# EAGLE design full_tds (EAGLE 7.7.0)
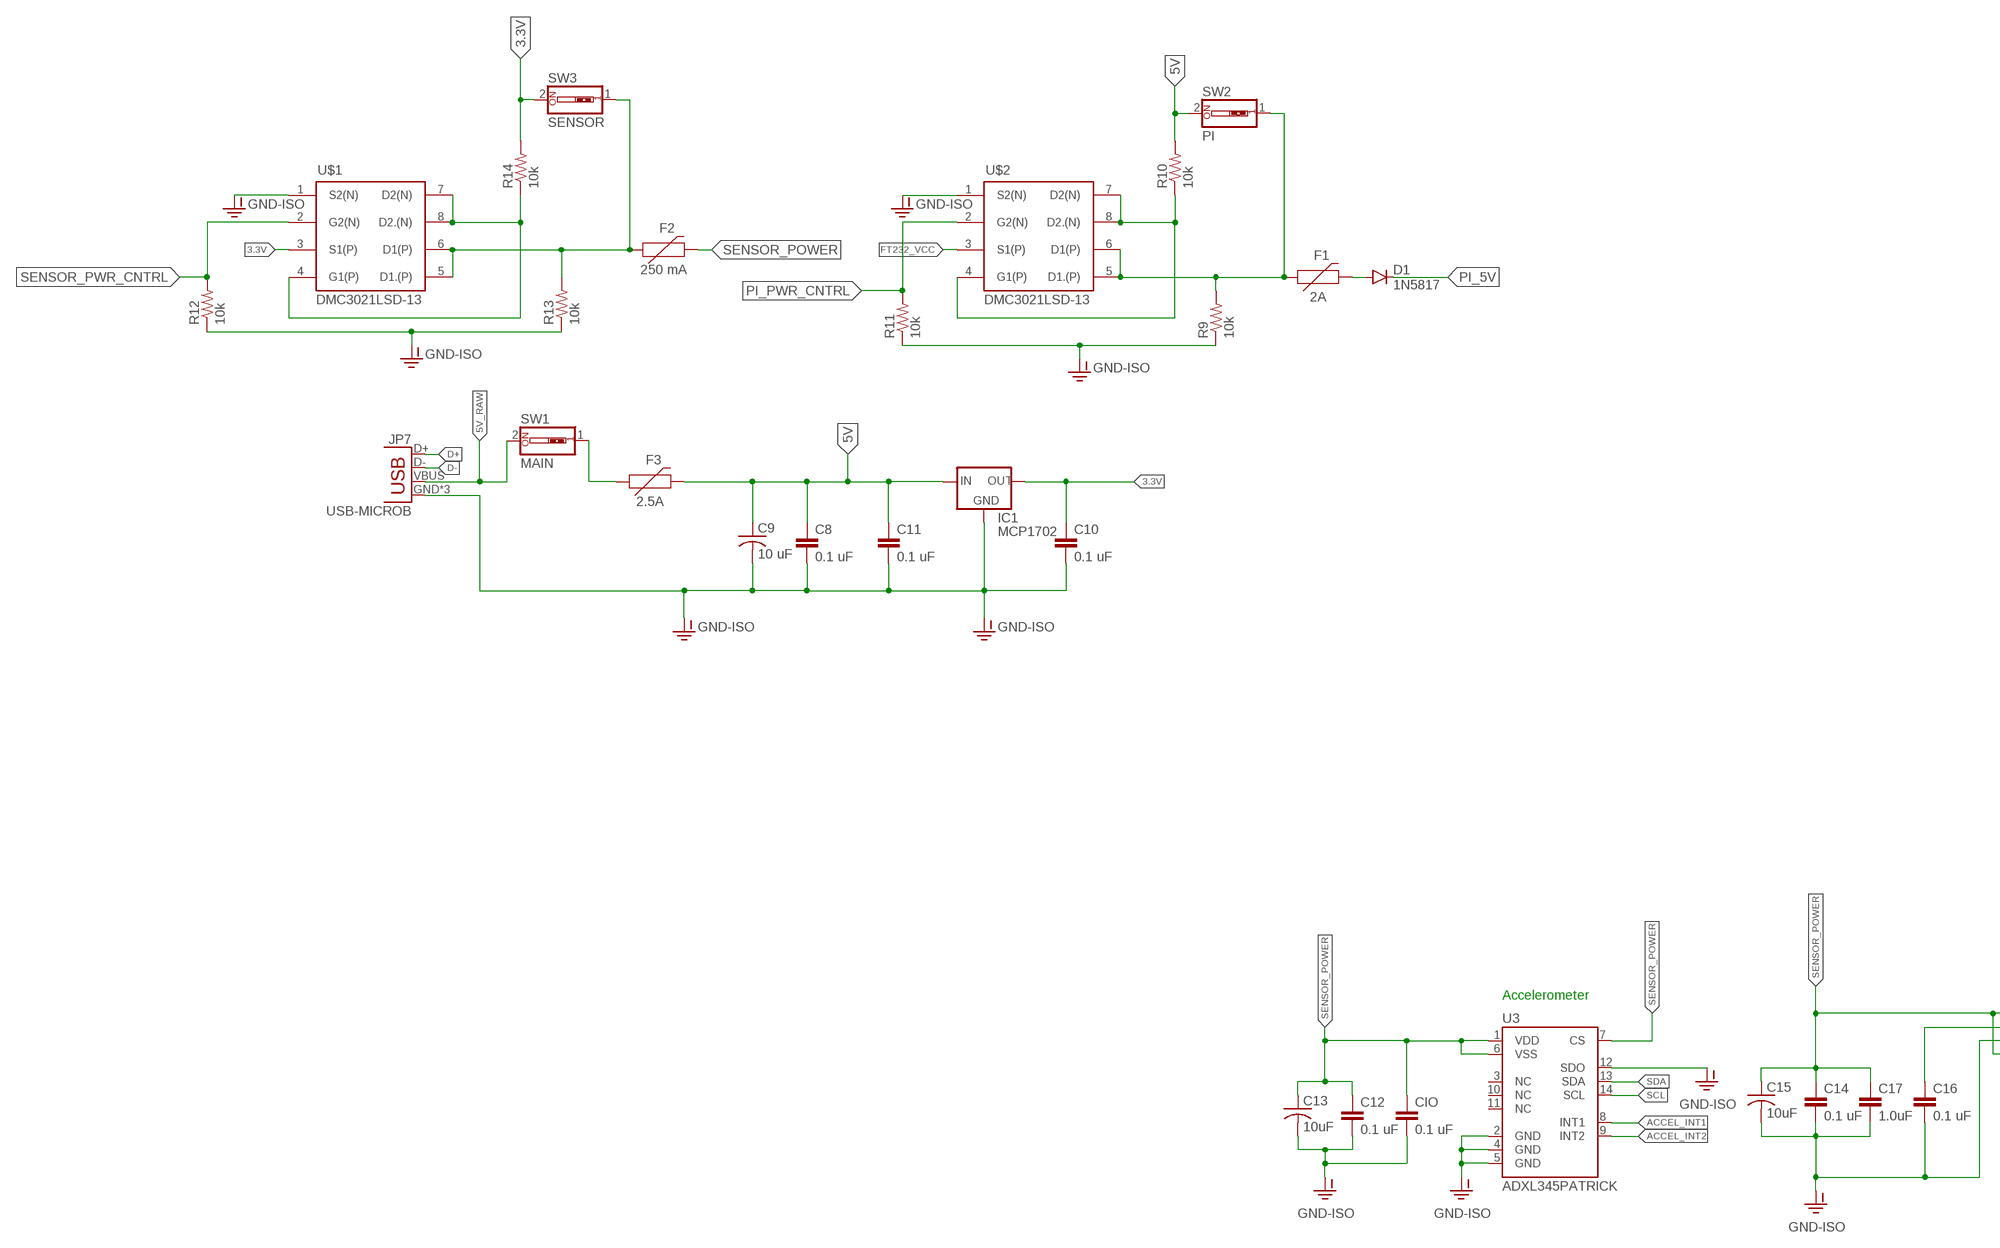
[diagram p0: schematic, sheet 1, part 1 of 2]
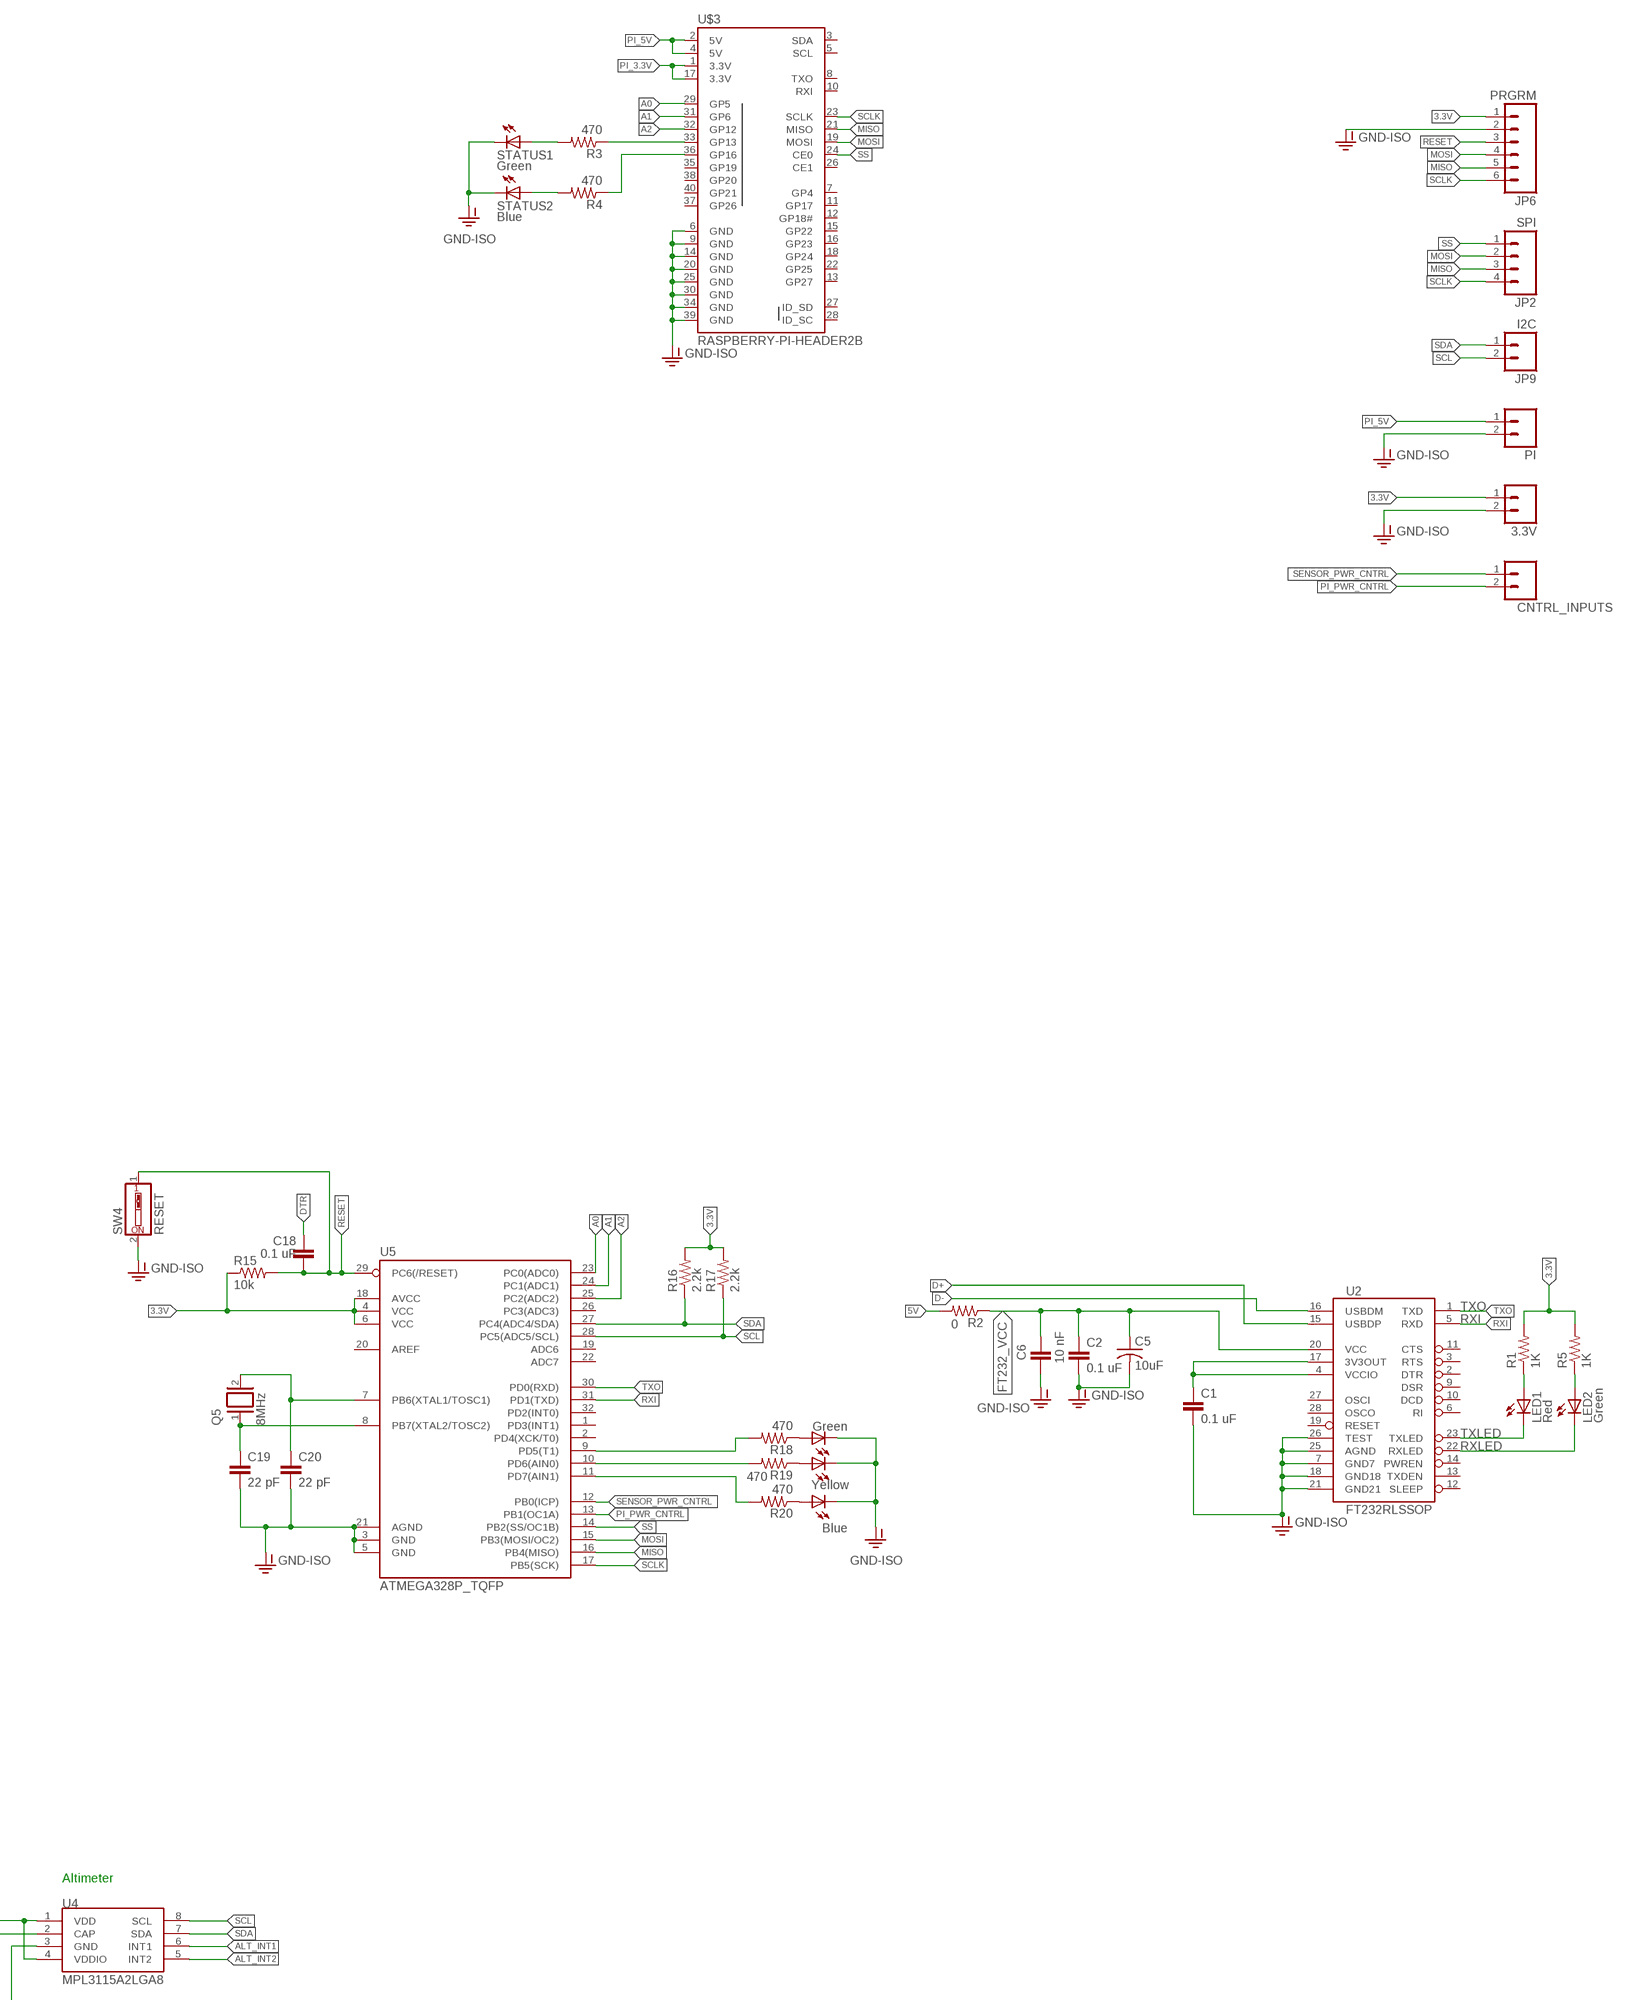
[diagram p1: schematic, sheet 1, part 2 of 2]

## Parts
3.3V  M02PTH  [1X02]
C1  0.1 uF  1.0UF-1206-50V-10%  [1206]
C2  0.1 uF  1.0UF-1206-50V-10%  [1206]
C5  10uF  C-USC1206  [C1206]
C6  10 nF  1.0UF-1206-50V-10%  [1206]
C8  0.1 uF  1.0UF-1206-50V-10%  [1206]
C9  10 uF  C-USC1206  [C1206]
C10  0.1 uF  1.0UF-1206-50V-10%  [1206]
C11  0.1 uF  1.0UF-1206-50V-10%  [1206]
C12  0.1 uF  1.0UF-1206-50V-10%  [1206]
C13  10uF  C-USC1206  [C1206]
C14  0.1 uF  1.0UF-1206-50V-10%  [1206]
C15  10uF  C-USC1206  [C1206]
C16  0.1 uF  1.0UF-1206-50V-10%  [1206]
C17  1.0uF  1.0UF-1206-50V-10%  [1206]
C18  0.1 uF  1.0UF-1206-50V-10%  [1206]
C19  22 pF  1.0UF-1206-50V-10%  [1206]
C20  22 pF  1.0UF-1206-50V-10%  [1206]
CIO  0.1 uF  1.0UF-1206-50V-10%  [1206]
CNTRL_INPUTS  M02PTH  [1X02]
D1  1N5817  DIODEPTH  [DIODE-1N4001]
F1  2A  PPTC_HALF-AMP  [1206]
F2  250 mA  PPTC_HALF-AMP  [1206]
F3  2.5A  PPTC_HALF-AMP  [1206]
IC1  MCP1702  MCP1700TRI  [TO92]
JP2  SPI  M04PTH  [1X04]
JP6  PRGRM  M06SILK_FEMALE_PTH  [1X06]
JP7  USB-MICROB  [USB-MICROB]
JP9  I2C  M02PTH  [1X02]
LED1  Red  LEDCHIPLED_1206  [CHIPLED_1206]
LED2  Green  LEDCHIPLED_1206  [CHIPLED_1206]
LED6  Green  LEDCHIPLED_1206  [CHIPLED_1206]
LED7  Yellow  LEDCHIPLED_1206  [CHIPLED_1206]
LED8  Blue  LEDCHIPLED_1206  [CHIPLED_1206]
PI  M02PTH  [1X02]
Q5  8MHz  XTAL/S  [QS]
R1  1K  RESISTOR1206  [1206]
R2  0  RESISTOR1206  [1206]
R3  470  RESISTOR1206  [1206]
R4  470  RESISTOR1206  [1206]
R5  1K  RESISTOR1206  [1206]
R9  10k  R-US_R1206  [R1206]
R10  10k  R-US_R1206  [R1206]
R11  10k  R-US_R1206  [R1206]
R12  10k  R-US_R1206  [R1206]
R13  10k  R-US_R1206  [R1206]
R14  10k  R-US_R1206  [R1206]
R15  10k  RESISTOR1206  [1206]
R16  2.2k  RESISTOR1206  [1206]
R17  2.2k  RESISTOR1206  [1206]
R18  470  RESISTOR1206  [1206]
R19  470  RESISTOR1206  [1206]
R20  470  RESISTOR1206  [1206]
STATUS1  Green  LEDCHIPLED_1206  [CHIPLED_1206]
STATUS2  Blue  LEDCHIPLED_1206  [CHIPLED_1206]
SW1  MAIN  SW_DIP-1  [EDG-01]
SW2  PI  SW_DIP-1  [EDG-01]
SW3  SENSOR  SW_DIP-1  [EDG-01]
SW4  RESET  SW_DIP-1  [EDG-01]
U2  FT232RLSSOP  [SSOP28DB]
U3  ADXL345PATRICK  [LGA14_1:1_PATRICK]
U4  MPL3115A2LGA8  [LGA8]
U5  ATMEGA328P_TQFP  [TQFP32-08]
U$1  DMC3021LSD-13  [SOIC-8]
U$2  DMC3021LSD-13  [SOIC-8]
U$3  RASPBERRY-PI-HEADER2B  [2X20-NOSILK]

## Nets
3.3V: 3.3V.1 C10.1 IC1.3(OUT) JP6.1 R1.2 R5.2 R14.2 R15.1 R16.2 R17.2 SW3.2 U5.4(VCC) U5.6(VCC) U5.18(AVCC) U$1.3(S1(P))
5V [pi]: C8.1 C9.1 C11.1 F3.2 IC1.2(IN) R2.2 R10.2 SW2.2
5V_RAW [pi]: JP7.VBUS SW1.2
5V_SWITCH [pi]: F3.1 SW1.1
A0: U5.23(PC0(ADC0)) U$3.29(GP5)
A1: U5.24(PC1(ADC1)) U$3.31(GP6)
A2: U5.25(PC2(ADC2)) U$3.32(GP12)
ACCEL_INT1: U3.8(INT1)
ACCEL_INT2: U3.9(INT2)
ALT_INT1: U4.6(INT1)
ALT_INT2: U4.5(INT2)
D+: JP7.D+ U2.15(USBDP)
D-: JP7.D- U2.16(USBDM)
DTR: C18.1
FT232_VCC: C2.1 C5.1 C6.2 R2.1 U2.20(VCC) U$2.3(S1(P))
FUSE_DIODE_PI [pi]: D1.A F1.2
GND-ISO [pi]: 3.3V.2 C1.2 C2.2 C5.2 C6.1 C8.2 C9.2 C10.2 C11.2 C12.2 C13.2 C14.2 C15.2 C16.2 C17.2 C19.2 C20.2 CIO.2 IC1.1(GND) JP6.2 JP7.GND JP7.MT1(GND) JP7.MT2(GND) LED6.C LED7.C LED8.C PI.2 R9.1 R11.1 R12.1 R13.1 STATUS1.C STATUS2.C SW4.2 U2.7(GND7) U2.18(GND18) U2.21(GND21) U2.25(AGND) U2.26(TEST) U3.2(GND) U3.4(GND) U3.5(GND) U3.12(SDO) U4.3(GND) U5.3(GND) U5.5(GND) U5.21(AGND) U$1.1(S2(N)) U$2.1(S2(N)) U$3.6(GND) U$3.9(GND) U$3.14(GND) U$3.20(GND) U$3.25(GND) U$3.30(GND) U$3.34(GND) U$3.39(GND)
GP13: R3.1 U$3.33(GP13)
GP16: R4.1 U$3.36(GP16)
MISO: JP2.3 JP6.5 U5.16(PB4(MISO)) U$3.21(MISO)
MOSI: JP2.2 JP6.4 U5.15(PB3(MOSI/OC2)) U$3.19(MOSI)
N$1: LED1.A R1.1
N$2: LED2.A R5.1
N$10: R4.2 STATUS2.A
N$11: R3.2 STATUS1.A
N$16: C16.1 U4.2(CAP)
N$25: LED6.A R18.1
N$26: LED7.A R19.1
N$27: LED8.A R20.1
PD5: R18.2 U5.9(PD5(T1))
PD6: R19.2 U5.10(PD6(AIN0))
PD7: R20.2 U5.11(PD7(AIN1))
PI_3.3V: U$3.1(3.3V) U$3.17(3.3V)
PI_5V [pi]: D1.C PI.1 U$3.2(5V) U$3.4(5V)
PI_N_DRAIN: R10.1 U$2.4(G1(P)) U$2.7(D2(N)) U$2.8(D2.(N))
PI_P_DRAIN [pi]: F1.1 R9.2 SW2.1 U$2.5(D1.(P)) U$2.6(D1(P))
PI_PWR_CNTRL: CNTRL_INPUTS.2 R11.2 U5.13(PB1(OC1A)) U$2.2(G2(N))
RESET: C18.2 JP6.3 R15.2 SW4.1 U5.29(PC6(/RESET))
RXI: U2.5(RXD) U5.31(PD1(TXD))
RXLED: LED2.C U2.22(RXLED)
SCL: JP9.2 R17.1 U3.14(SCL) U4.8(SCL) U5.28(PC5(ADC5/SCL))
SCLK: JP2.4 JP6.6 U5.17(PB5(SCK)) U$3.23(SCLK)
SDA: JP9.1 R16.1 U3.13(SDA) U4.7(SDA) U5.27(PC4(ADC4/SDA))
SENS_N_DRAIN: R14.1 U$1.4(G1(P)) U$1.7(D2(N)) U$1.8(D2.(N))
SENS_P_DRAIN: F2.1 R13.2 SW3.1 U$1.5(D1.(P)) U$1.6(D1(P))
SENSOR_POWER: C12.1 C13.1 C14.1 C15.1 C17.1 CIO.1 F2.2 U3.1(VDD) U3.6(VSS) U3.7(CS) U4.1(VDD) U4.4(VDDIO)
SENSOR_PWR_CNTRL: CNTRL_INPUTS.1 R12.2 U5.12(PB0(ICP)) U$1.2(G2(N))
SS: JP2.1 U5.14(PB2(SS/OC1B)) U$3.24(CE0)
TXLED: LED1.C U2.23(TXLED)
TXO: U2.1(TXD) U5.30(PD0(RXD))
VCCIO: C1.1 U2.4(VCCIO) U2.17(3V3OUT)
XTAL1: C20.1 Q5.2 U5.7(PB6(XTAL1/TOSC1))
XTAL2: C19.1 Q5.1 U5.8(PB7(XTAL2/TOSC2))
Unconnected: U2.2(DTR) U2.3(RTS) U2.6(RI) U2.9(DSR) U2.10(DCD) U2.11(CTS) U2.12(SLEEP) U2.13(TXDEN) U2.14(PWREN) U2.19(RESET) U2.27(OSCI) U2.28(OSCO) U3.3(NC) U3.10(NC) U3.11(NC) U5.1(PD3(INT1)) U5.2(PD4(XCK/T0)) U5.19(ADC6) U5.20(AREF) U5.22(ADC7) U5.26(PC3(ADC3)) U5.32(PD2(INT0)) U$3.3(SDA) U$3.5(SCL) U$3.7(GP4) U$3.8(TXO) U$3.10(RXI) U$3.11(GP17) U$3.12(GP18#) U$3.13(GP27) U$3.15(GP22) U$3.16(GP23) U$3.18(GP24) U$3.22(GP25) U$3.26(CE1) U$3.27(ID_SD) U$3.28(ID_SC) U$3.35(GP19) U$3.37(GP26) U$3.38(GP20) U$3.40(GP21)

## Notes on the sheet
- Altimeter
- Accelerometer

## Library data of the parts
3.3V CNTRL_INPUTS JP9 PI = SparkFun-Connectors:M02: Standard 2-pin 0.1" header. Use with - straight break away headers ( PRT-00116) - right angle break away headers (PRT-00553) - swiss pins (PRT-00743) - machine pins (PRT-00117) - female headers (PRT-00115) Molex polarized connector foot print use with: PRT-08233 with associated crimp pins and housings. 2.54_SCREWTERM for use with PRT-10571. 3.5mm Screw Terminal footprints for PRT-08084 5mm Screw Terminal footprints for use with PRT-08432
C1 C2 C6 C8 C10-C12 C14 C16 C18-C20 CIO = SparkFun-Capacitors:1.0UF: 1µF ceramic capacitors A capacitor is a passive two-terminal electrical component used to store electrical energy temporarily in an electric field.; PROD_ID: CAP-09822; VALUE: 1.0uF
C5 C9 C13 C15 = adafruit:C-US: CAPACITOR, American symbol
C17 = SparkFun-Capacitors:1.0UF: 1µF ceramic capacitors A capacitor is a passive two-terminal electrical component used to store electrical energy temporarily in an electric field.; PROD_ID: CAP-09822
D1 = SparkFun-DiscreteSemi:DIODE: Diode These are standard reverse protection diodes and small signal diodes. SMA package can handle up to about 1A. SOD-323 can handle about 200mA. What the SOD-323 package when ordering, there are some mfgs out there that are 5-pin packages.
F1-F3 = SparkFun-Fuses:PPTC: Resettable Fuse PPTC Resettable Fuse. Really a sort of resistor with a polymeric positive temperature coefficient whose resistance increases dramatically with an increase in temperature. When heated by the power passing through the resistance rises causing the current to be limited, protecting the circuit. This is achieved by the transition of the polymer from a crystalline to an amorphous state where the conductive carbon separates breaking the conductive pathways found in the cool crystalline structure. When a PPTC cools back down it resumes conducting letting the circuit turn back on. SparkFun Products: SparkFun RedBoard - Programmed with Arduino <https://www.sparkfun.com/products/12757> Pro Micro - 5V/16MHz <https://www.sparkfun.com/products/12640> Arduino Pro 328 - 5V/16MHz <https://www.sparkfun.com/products/10915> MP3 Trigger <https://www.sparkfun.com/products/13720>; PROD_ID: RES-08585; VALUE: 6V/0.5A
IC1 = adafruit:MCP1700: VOLTAGE REGULATOR
JP2 = SparkFun-Connectors:M04: Header 4 Standard 4-pin 0.1" header. Use with straight break away headers (SKU : PRT-00116), right angle break away headers (PRT-00553), swiss pins (PRT-00743), machine pins (PRT-00117), and female headers (PRT-00115). Molex polarized connector foot print use with SKU : PRT-08231 with associated crimp pins and housings. 1MM SMD Version SKU: PRT-10208
JP6 = SparkFun-Connectors:M06: Header 6 Standard 6-pin 0.1" header. Use with straight break away headers (SKU : PRT-00116), right angle break away headers (PRT-00553), swiss pins (PRT-00743), machine pins (PRT-00117), and female headers (PRT-00115). Molex polarized connector foot print use with SKU : PRT-08094 with associated crimp pins and housings. NOTES ON THE VARIANTS LOCK and LOCK_LONGPADS... This footprint was designed to help hold the alignment of a through-hole component (i.e. 6-pin header) while soldering it into place. You may notice that each hole has been shifted either up or down by 0.005 of an inch from it's more standard position (which is a perfectly straight line). This slight alteration caused the pins (the squares in the middle) to touch the edges of the holes. Because they are alternating, it causes a "brace" to hold the component in place. 0.005 has proven to be the perfect amount of "off-center" position when using our standard breakaway headers. Although looks a little odd when you look at the bare footprint, once you have a header in there, the alteration is very hard to notice. Also,if you push a header all the way into place, it is covered up entirely on the bottom side. This idea of altering the position of holes to aid alignment will be further integrated into the Sparkfun Library for other footprints. It can help hold any component with 3 or more connection pins.; PROD_ID: CONN-08437
JP7 = SparkFun-Connectors:USB: USB Connectors USB-B-PTH is fully proven SKU : PRT-00139/CONN-08278 USB-miniB is fully proven SKU : PRT-00587 USB-A-PCB is untested. USB-A-H is throughly reviewed, but untested. Spark Fun Electronics SKU : PRT-00437 USB-B-SMT is throughly reviewed, but untested. Needs silkscreen touching up. USB-A-S has not been used/tested USB-MB-H has not been used/tested USB-MICROB has been used. CONN-09505; PROD_ID: CONN-09505
LED1 LED2 LED6-LED8 STATUS1 STATUS2 = adafruit:LED: LED OSRAM: - CHIPLED LG R971, LG N971, LY N971, LG Q971, LY Q971, LO R971, LY R971 LH N974, LH R974 LS Q976, LO Q976, LY Q976 LO Q996 - Hyper CHIPLED LW Q18S LB Q993, LB Q99A, LB R99A - SideLED LS A670, LO A670, LY A670, LG A670, LP A670 LB A673, LV A673, LT A673, LW A673 LH A674 LY A675 LS A676, LA A676, LO A676, LY A676, LW A676 LS A679, LY A679, LG A679 - Hyper Micro SIDELED® LS Y876, LA Y876, LO Y876, LY Y876 LT Y87S - SmartLED LW L88C, LW L88S LB L89C, LB L89S, LG L890 LS L89K, LO L89K, LY L89K LS L896, LA L896, LO L896, LY L896 - TOPLED LS T670, LO T670, LY T670, LG T670, LP T670 LSG T670, LSP T670, LSY T670, LOP T670, LYG T670 LG T671, LOG T671, LSG T671 LB T673, LV T673, LT T673, LW T673 LH T674 LS T676, LA T676, LO T676, LY T676, LB T676, LH T676, LSB T676, LW T676 LB T67C, LV T67C, LT T67C, LS T67K, LO T67K, LY T67K, LW E67C LS E67B, LA E67B, LO E67B, LY E67B, LB E67C, LV E67C, LT E67C LW T67C LS T679, LY T679, LG T679 LS T770, LO T770, LY T770, LG T770, LP T770 LB T773, LV T773, LT T773, LW T773 LH T774 LS E675, LA E675, LY E675, LS T675 LS T776, LA T776, LO T776, LY T776, LB T776 LHGB T686 LT T68C, LB T68C - Hyper Mini TOPLED® LB M676 - Mini TOPLED Santana® LG M470 LS M47K, LO M47K, LY M47K Source: http://www.osram.convergy.de/
Q5 = special:XTAL/S: CRYSTAL
R1 R2 R5 = SparkFun-Resistors:RESISTOR: Resistor Basic schematic elements and footprints for 0603, 1206, and PTH resistors.
R3 R4 R15-R20 = SparkFun-Passives:RESISTOR: Resistor Basic schematic elements and footprints for 0603, 1206, and PTH resistors.
R9-R14 = adafruit:R-US_: RESISTOR, American symbol
SW1-SW4 = special:SW_DIP-1: DIP SWITCH
U2 = SparkFun:FT232RL: USB UART FT232RL 4th Generation USB UART (USB <-> Serial) Controller. Spark Fun Electronics SKU : COM-00650
U3 = Testing:ADXL345
U4 = SparkFun-Sensors:MPL3115A2: Altimeter/Pressure Sensor, I2C, 1.95V-3.6V supply, 50 to 110kPa
U5 = SparkFun-IC-Microcontroller:ATMEGA328P_TQFP: Popular 328P in QFP Storefront component: ATmega328 - TQFP <https://www.sparkfun.com/products/13448> (COM-13448) Datasheet <http://www.sparkfun.com/datasheets/Components/SMD/ATMega328.pdf> SparkFun Products SparkFun RedBoard - Programmed with Arduino <https://www.sparkfun.com/products/12757> (DEV-12757) Arduino Pro Mini 328 - 5V/16MHz <https://www.sparkfun.com/products/11113> (DEV-11113) Arduino Pro Mini 328 - 3.3V/8MHz <https://www.sparkfun.com/products/11114> (DEV-11114) SparkFun OpenLog <https://www.sparkfun.com/products/13712> (DEV-13712) SparkFun MicroView - OLED Arduino Module <https://www.sparkfun.com/products/12923> (DEV-12923) SparkFun Digital Sandbox <https://www.sparkfun.com/products/12651> (DEV-12651) SparkFun PicoBoard <https://www.sparkfun.com/products/11888> (WIG-11888) Arduino Fio <https://www.sparkfun.com/products/10116> (DEV-10116) LilyPad Arduino 328 Main Board <https://www.sparkfun.com/products/13342> (DEV-13342) SparkFun RedStick <https://www.sparkfun.com/products/13741> (DEV-13741) LilyPad MP3 <https://www.sparkfun.com/products/11013> (DEV-11013) LilyPad Arduino SimpleSnap <https://www.sparkfun.com/products/10941> (DEV-10941) SparkFun Stepoko <https://www.sparkfun.com/products/13899> (ROB-13899) SparkFun Geiger Counter <https://www.sparkfun.com/products/11345> (SEN-11345) SparkFun EL Sequencer <https://www.sparkfun.com/products/12781> (COM-12781) Arduino Pro 328 - 5V/16MHz <https://www.sparkfun.com/products/10915> (DEV-10915) CryptoCape <https://www.sparkfun.com/products/12773> (DEV-12773) SparkFun IR Thermometer Evaluation Board - MLX90614 <https://www.sparkfun.com/products/10740> (SEN-10740) SparkFun RedBot Mainboard <https://www.sparkfun.com/products/12097> (ROB-12097) Arduino Pro 328 - 3.3V/8MHz <https://www.sparkfun.com/products/10914> (DEV-10914) SparkFun Block for Intel® Edison - Arduino <https://www.sparkfun.com/products/13036> (DEV-13036) SparkFun Simon Says - Surface Mount Soldering Kit <https://www.sparkfun.com/products/10935> (KIT-10935) SparkFun 7-Segment Serial Display - Red <https://www.sparkfun.com/products/11441> (COM-11441) SparkFun 7-Segment Serial Display - White <https://www.sparkfun.com/products/11629> (COM-11629) SparkFun 7-Segment Serial Display - Yellow <https://www.sparkfun.com/products/11443> (COM-11443) SparkFun 7-Segment Serial Display - Kelly Green <https://www.sparkfun.com/products/11440> (COM-11440) SparkFun 7-Segment Serial Display - Blue <https://www.sparkfun.com/products/11442> (COM-11442) SparkFun OpenSegment Serial Display - 20mm (Blue) <https://www.sparkfun.com/products/11647> (COM-11647) SparkFun OpenSegment Serial Display - 20mm (Green) <https://www.sparkfun.com/products/11646> (COM-11646) SparkFun OpenSegment Serial Display - 20mm (White) <https://www.sparkfun.com/products/11648> (COM-11648) SparkFun OpenSegment Serial Display - 20mm (Red) <https://www.sparkfun.com/products/11644> (COM-11644) SparkFun OpenSegment Serial Display - 20mm (Yellow) <https://www.sparkfun.com/products/11645> (COM-11645) SparkFun OpenSegment Shield <https://www.sparkfun.com/products/13190> (DEV-13190); PROD_ID: IC-09069
U$1 U$2 = custom:DMC3021LSD
U$3 = custom:RASPBERRY-PI-HEADER

## Net classes
1 actuator: width 0.813 mm, clearance 0.229 mm
2 pi: width 0.508 mm

## Board
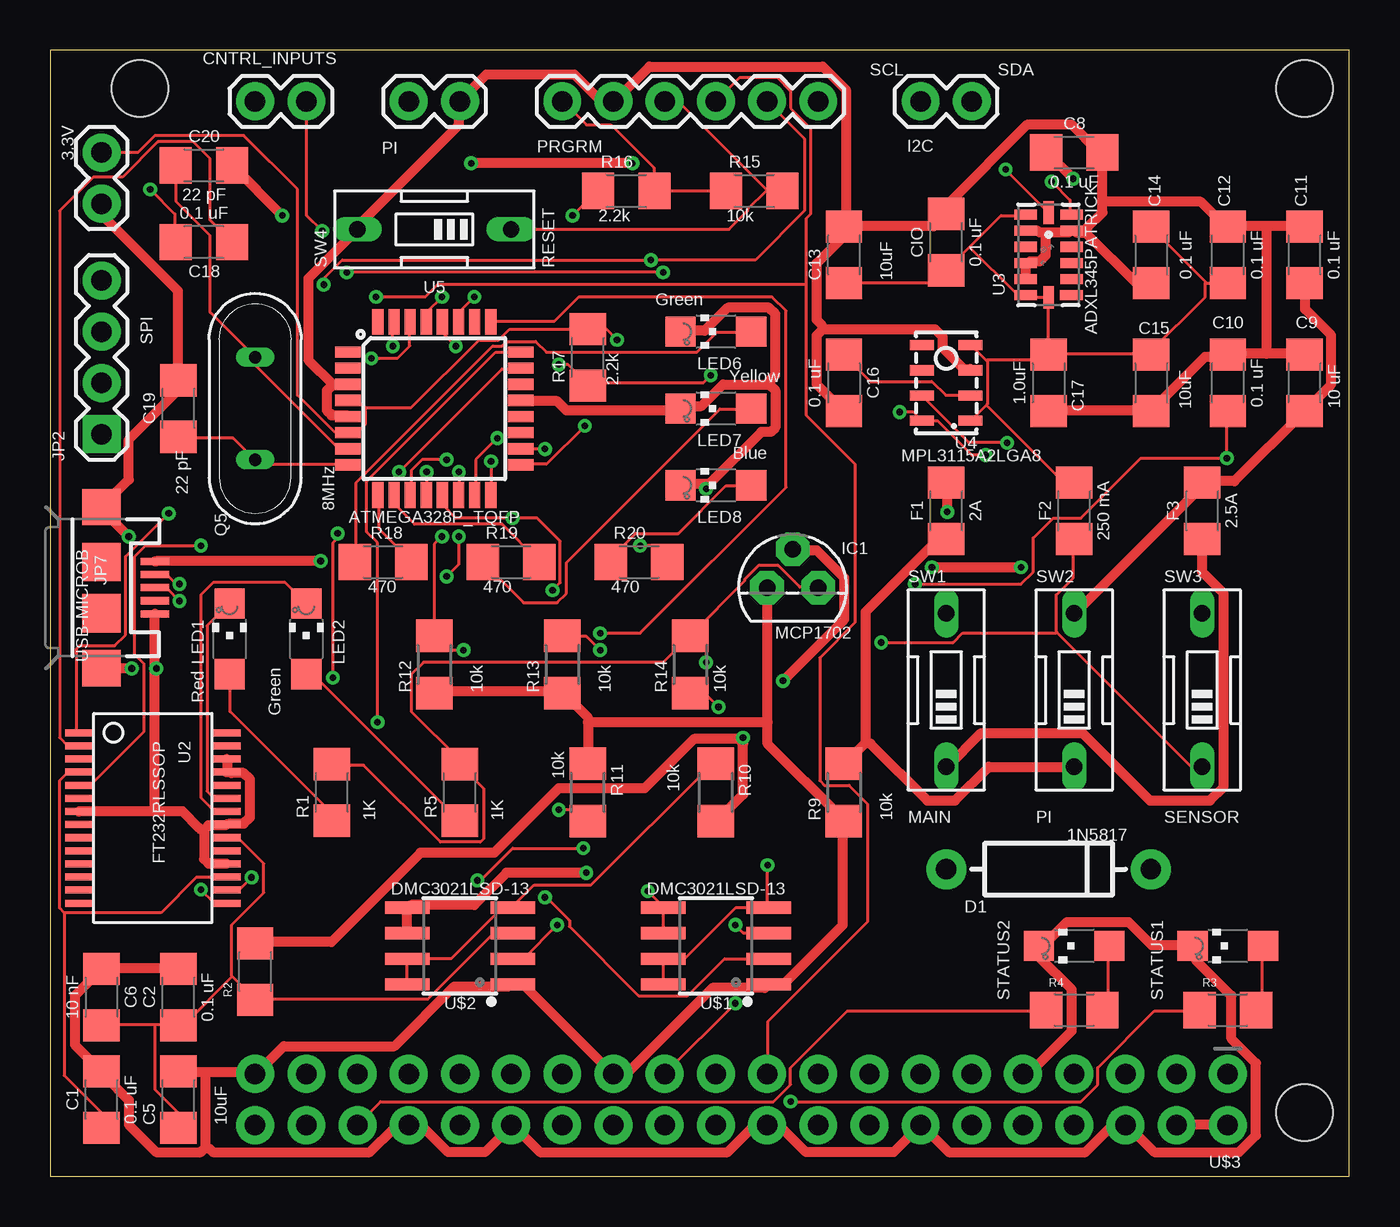
[diagram p2: board, top side]
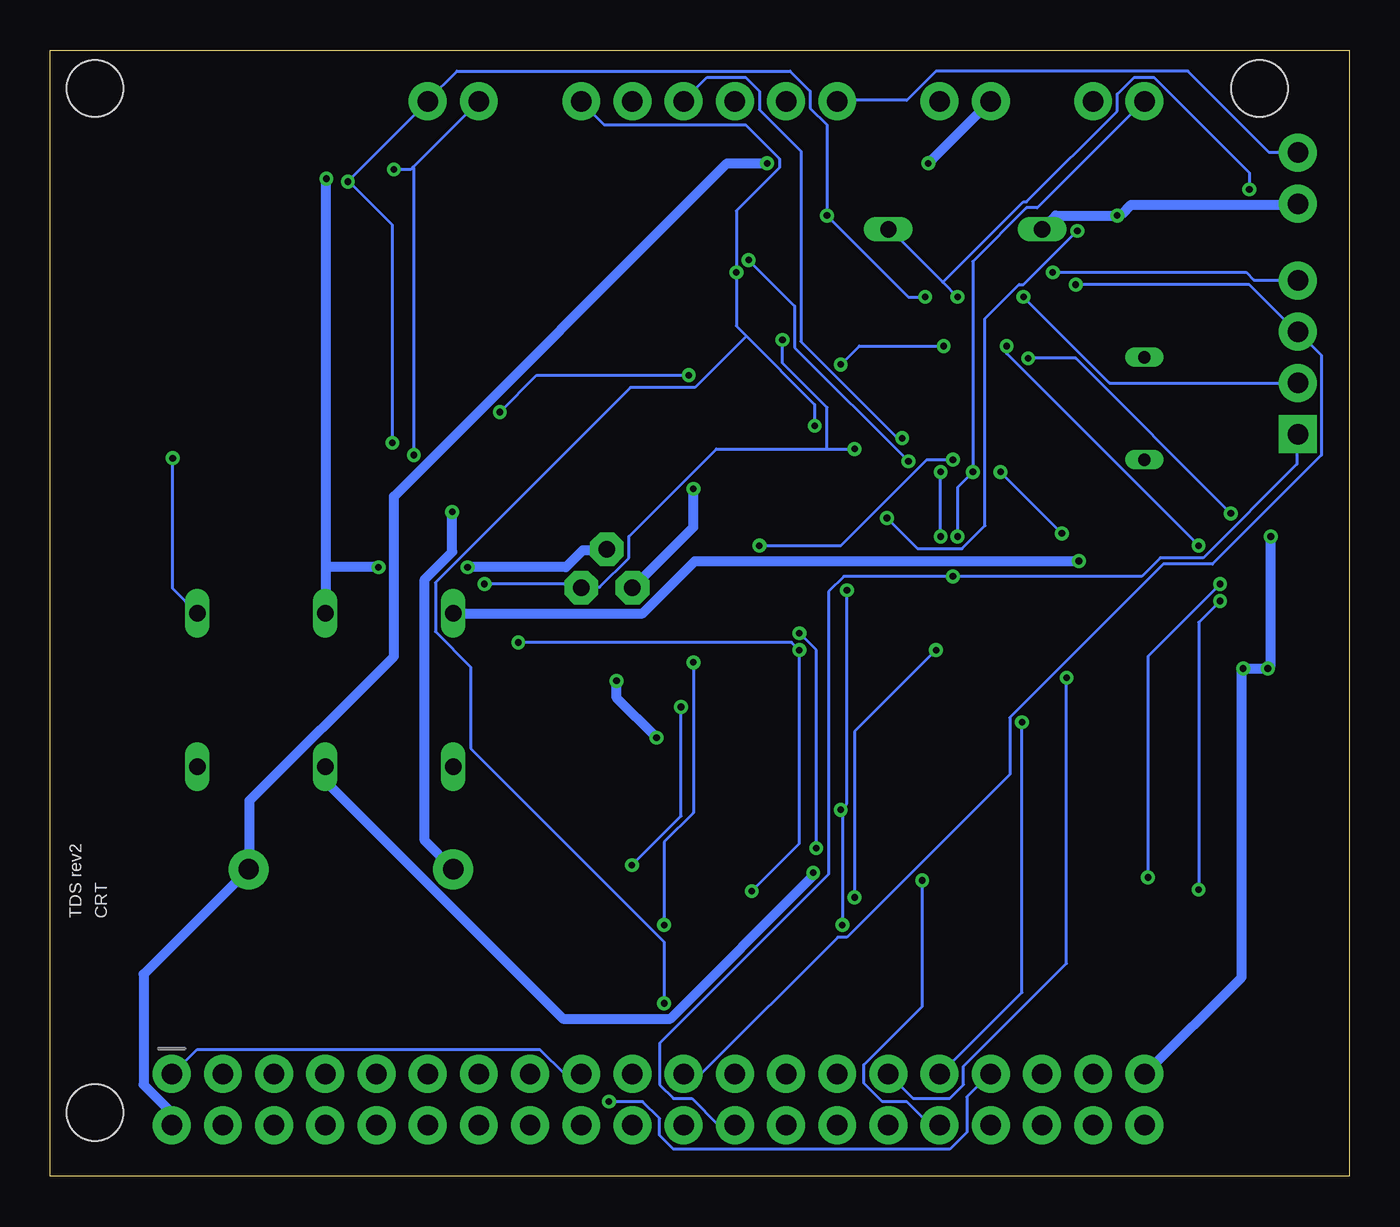
[diagram p3: board, bottom side, seen from below]

Size 64.44 x 55.87 mm. Coordinates in mm from the lower left corner, seen from the top.
Outline: 0,0 64.44,0 64.44,55.87 0,55.87 0,0
Copper layers (1*16): Top 0.0356mm / dielectric 1.5011mm / Bottom 0.0356mm
Design rules "LaenPCBOrder": minimum track width 6mil, minimum drill 13mil, track to track 6mil, track to pad 6mil, pad to pad 6mil, via to via 6mil, smd to smd 6mil, copper to edge 15mil, drill to drill 6mil, minimum pad ring 7mil, minimum via ring 7mil, stop-mask expansion 3mil, vias tented up to drill 0mil, thermal gap 10mil
Holes 2.8 mm at 62.23,53.98 62.23,3.17 4.44,53.98

### Footprints (pad centres in the part's own frame; a part is rotated, then mirrored left to right if it is on the bottom)
1X02 = drill 1.016 pad 1.88: 1 0,0; 2 2.54,0
1206 = smd 1.6 x 1.8: 1 -1.4,0; 2 1.4,0
C1206 = smd 1.6 x 1.8: 1 -1.4,0; 2 1.4,0
DIODE-1N4001 = drill 1 pad 1.981: A -5.08,0; C 5.08,0
TO92 = drill 0.813 pad 1.676 octagon: 1 -1.27,0; 2 0,1.905; 3 1.27,0
1X04 = drill 1.016 pad 1.88 square: 1 0,0 | drill 1.016 pad 1.88: 2 2.54,0; 3 5.08,0; 4 7.62,0
1X06 = drill 1.016 pad 1.88: 1 0,0; 2 2.54,0; 3 5.08,0; 4 7.62,0; 5 10.16,0; 6 12.7,0
USB-MICROB = smd 0.35 x 1.4: D+ 0,2.65; D- -0.65,2.65; GND 1.3,2.65; ID 0.65,2.65; VBUS -1.3,2.65 | smd 1.8 x 1.9: MT1 -4,0; MT2 4,0 | smd 1.9 x 1.9: P$1 -1.27,0; P$2 1.27,0
CHIPLED_1206 = smd 1.5 x 1.5: A 0,-1.75; C 0,1.75
QS = drill 0.61 long: 1 -2.54,0; 2 2.54,0
R1206 = smd 1.6 x 1.803: 1 -1.422,0; 2 1.422,0
EDG-01 = drill 0.813 long: 1 0,-3.81; 2 0,3.81
SSOP28DB = smd 0.348 x 1.397: 1 -4.225,-3.656; 2 -3.575,-3.656; 3 -2.925,-3.656; 4 -2.275,-3.656; 5 -1.625,-3.656; 6 -0.975,-3.656; 7 -0.325,-3.656; 8 0.325,-3.656; 9 0.975,-3.656; 10 1.625,-3.656; 11 2.275,-3.656; 12 2.925,-3.656; 13 3.575,-3.656; 14 4.225,-3.656; 15 4.225,3.656; 16 3.575,3.656; 17 2.925,3.656; 18 2.275,3.656; 19 1.625,3.656; 20 0.975,3.656; 21 0.325,3.656; 22 -0.325,3.656; 23 -0.975,3.656; 24 -1.625,3.656; 25 -2.275,3.656; 26 -2.925,3.656; 27 -3.575,3.656; 28 -4.225,3.656
LGA14_1:1_PATRICK = smd 0.5 x 1.124: 1 2,1.138; 2 1.2,1.138; 3 0.4,1.138; 4 -0.4,1.138; 5 -1.2,1.138; 6 -2,1.138; 8 -2,-1.13; 9 -1.2,-1.138; 10 -0.4,-1.138; 11 0.4,-1.138; 12 1.2,-1.138; 13 2,-1.138 | smd 1.124 x 0.5: 7 -2.1,0; 14 2.1,0
LGA8 = smd 1.2 x 0.5: 1 -1.2,1.875; 2 -1.2,0.625; 3 -1.2,-0.625; 4 -1.2,-1.875; 5 1.2,-1.875; 6 1.2,-0.625; 7 1.2,0.625; 8 1.2,1.875
TQFP32-08 = smd 1.27 x 0.559: 1 -4.293,2.8; 2 -4.293,2; 3 -4.293,1.2; 4 -4.293,0.4; 5 -4.293,-0.4; 6 -4.293,-1.2; 7 -4.293,-2; 8 -4.293,-2.8; 17 4.293,-2.8; 18 4.293,-2; 19 4.293,-1.2; 20 4.293,-0.4; 21 4.293,0.4; 22 4.293,1.2; 23 4.293,2; 24 4.293,2.8 | smd 0.559 x 1.27: 9 -2.8,-4.293; 10 -2,-4.293; 11 -1.2,-4.293; 12 -0.4,-4.293; 13 0.4,-4.293; 14 1.2,-4.293; 15 2,-4.293; 16 2.8,-4.293; 25 2.8,4.293; 26 2,4.293; 27 1.2,4.293; 28 0.4,4.293; 29 -0.4,4.293; 30 -1.2,4.293; 31 -2,4.293; 32 -2.8,4.293
SOIC-8 = smd 0.61 x 2.21: 1 -1.905,-2.616; 2 -0.635,-2.616; 3 0.635,-2.616; 4 1.905,-2.616; 5 1.905,2.616; 6 0.635,2.616; 7 -0.635,2.616; 8 -1.905,2.616
2X20-NOSILK = drill 1.016 pad 1.88: 1 0,0; 2 0,2.54; 3 2.54,0; 4 2.54,2.54; 5 5.08,0; 6 5.08,2.54; 7 7.62,0; 8 7.62,2.54; 9 10.16,0; 10 10.16,2.54; 11 12.7,0; 12 12.7,2.54; 13 15.24,0; 14 15.24,2.54; 15 17.78,0; 16 17.78,2.54; 17 20.32,0; 18 20.32,2.54; 19 22.86,0; 20 22.86,2.54; 21 25.4,0; 22 25.4,2.54; 23 27.94,0; 24 27.94,2.54; 25 30.48,0; 26 30.48,2.54; 27 33.02,0; 28 33.02,2.54; 29 35.56,0; 30 35.56,2.54; 31 38.1,0; 32 38.1,2.54; 33 40.64,0; 34 40.64,2.54; 35 43.18,0; 36 43.18,2.54; 37 45.72,0; 38 45.72,2.54; 39 48.26,0; 40 48.26,2.54

### Placement (x,y rotation side)
3.3V  2.54,50.8 270 top
C1  2.54,3.81 90 top
C2  6.35,8.89 90 top
C5  6.35,3.81 90 top
C6  2.54,8.89 270 top
C8  50.8,50.8 0 top
C9  62.23,39.37 90 top
C10  58.42,39.37 90 top
C11  62.23,45.72 90 top
C12  58.42,45.72 90 top
C13  39.37,45.72 90 top
C14  54.61,45.72 270 top
C15  54.61,39.37 270 top
C16  39.37,39.37 270 top
C17  49.53,39.37 270 top
C18  7.62,46.36 180 top
C19  6.35,38.1 90 top
C20  7.62,50.16 0 top
CIO  44.45,46.36 90 top
CNTRL_INPUTS  10.16,53.34 0 top
D1  49.53,15.24 0 top
F1  44.45,33.02 90 top
F2  50.8,33.02 90 top
F3  57.15,33.02 90 top
IC1  36.83,29.21 0 top
JP2  2.54,36.83 90 top
JP6  25.4,53.34 0 top
JP7  2.54,29.21 270 top
JP9  45.72,53.34 180 top
LED1  8.89,26.67 0 top
LED2  12.7,26.67 0 top
LED6  33.02,41.91 90 top
LED7  33.02,38.1 90 top
LED8  33.02,34.29 90 top
PI  17.78,53.34 0 top
Q5  10.16,38.1 90 top
R1  13.97,19.05 90 top
R2  10.16,10.16 90 top
R3  58.42,8.25 0 top
R4  50.8,8.25 0 top
R5  20.32,19.05 90 top
R9  39.37,19.05 90 top
R10  33.02,19.05 270 top
R11  26.67,19.05 270 top
R12  19.05,25.4 90 top
R13  25.4,25.4 90 top
R14  31.75,25.4 90 top
R15  34.92,48.9 0 top
R16  28.57,48.9 0 top
R17  26.67,40.64 90 top
R18  16.51,30.48 0 top
R19  22.86,30.48 0 top
R20  29.21,30.48 0 top
STATUS1  58.42,11.43 90 top
STATUS2  50.8,11.43 90 top
SW1  44.45,24.13 0 top
SW2  50.8,24.13 0 top
SW3  57.15,24.13 0 top
SW4  19.05,46.99 90 top
U2  5.08,17.78 270 top
U3  49.53,45.72 90 top
U4  44.45,39.37 180 top
U5  19.05,38.1 0 top
U$1  33.02,11.43 90 top
U$2  20.32,11.43 90 top
U$3  58.42,5.08 180 top

### Tracks (layer width: path | path; a pad name or v marks a point on that pad's centre or on a via)
3.3V  (via drill 0.33)
  Top 0.152: R15.1 R16.2 29.95,48.9 29.95,50.04 27.81,52.17 26.59,52.17 25.45,53.31 JP6.1 | 15.58,38.11 15.24,38.46 14.78,38.46 U5.4 | 15.58,38.11 15.62,38.08 15.62,37.31 15.24,36.93 14.78,36.93 U5.6 14.71,36.93 14.1,36.93 12.27,38.76 12.27,48.97 9.6,51.64 5.18,51.64 4.34,50.8 3.3V.1 | R17.2 22.78,42.04 22.25,41.5 21.26,41.5 17.91,38.15 15.62,38.15 15.58,38.11 | C10.1 58.37,37.92 v58.37,35.64 54.1,35.64 51.13,32.66 49.76,32.66 48.77,31.67 48.77,30 48.16,29.39 v42.9,29.39 | R1.2 14.02,20.4 15.54,20.4 19.35,16.59 21.34,16.59 21.49,16.74 21.49,19.25 20.34,20.4 R5.2 20.27,20.47 20.27,20.7 17.91,23.06 17.91,24.89 18.52,25.5 30.4,25.5 31.7,26.8 R14.2 | v24.54,36.09 23.39,36.09 U5.18 | R14.2 31.77,26.87 34.44,29.54 34.44,29.62 35.13,30.3 36.12,30.3 37.19,29.23 38.1,29.23 IC1.3 | v33.98,12.47 34.37,12.09 35.59,12.09 U$1.3 | v32.54,25.5 32.54,26.04 31.77,26.8 R14.2 | R17.2 27.58,42.04 v28.12,41.5 | R17.2
  Bottom 0.152: 3.3V.1 3.96,50.8 8,54.84 20.5,54.84 21.95,53.39 25.38,53.39 JP6.1 | v58.37,35.64 58.37,29.16 SW3.2 | 25.91,36.09 31.39,36.09 35.74,31.75 35.74,30.68 37.19,29.23 38.1,29.23 | 25.91,36.09 v24.54,36.09 | v33.98,12.47 33.98,16.59 32.54,18.03 v32.54,25.5 | v42.9,29.39 38.25,29.39 38.1,29.23 | 38.1,29.23 IC1.3 | v28.12,41.5 28.12,40.36 25.91,38.15 25.91,36.09
5V  (via drill 0.33)
  Top 0.508: C11.1 62.26,44.25 62.26,43.03 63.55,41.73 63.55,39.29 62.41,38.15 C9.1 62.18,37.92 58.75,34.49 57.15,34.49 F3.2 57.07,34.19 50.82,27.94 SW2.2 | v50.75,49.51 49.45,50.8 C8.1 | 34.14,21.69 31.93,21.69 29.49,19.25 25.22,19.25 22.02,16.05 18.36,16.05 13.94,11.63 10.21,11.63 R2.2 | 34.14,21.69 34.37,21.46 34.37,18.95 33.07,17.65 R10.2 | v36.35,24.59 39.39,27.64 39.39,29.69 38.02,31.06 36.88,31.06 IC1.2 | v34.37,21.77 34.14,21.69 | v43.74,30.23 v48.16,30.23
  Bottom 0.508: 50.75,30.23 50.75,27.94 SW2.2 | 50.75,30.23 v50.75,49.51 | v36.35,24.59 36.35,23.75 v34.37,21.77 | v48.16,30.23 50.75,30.23 | v43.74,30.23 38.86,30.23 38.02,31.06 36.88,31.06 IC1.2
5V_RAW  (via drill 0.33)
  Top 0.508: v13.41,30.53 5.26,30.53 JP7.VBUS
  Bottom 0.508: v13.41,30.53 32.46,30.53 35.05,27.94 SW1.2
5V_SWITCH
  Top 0.508: F3.1 57.15,30 58.22,28.93 58.22,19.33 57.53,18.64 54.56,18.64 51.21,22 46.18,22 44.5,20.32 SW1.1
A0  (via drill 0.33)
  Top 0.152: v17.3,34.95 22.4,40.06 23.32,40.06 U5.23 | v14.25,31.9 14.25,31.67 14.02,31.45 v14.02,24.74
  Bottom 0.152: v14.25,31.9 v17.3,34.95 | v14.02,24.74 14.02,10.57 19.13,5.46 19.13,4.55 19.81,3.86 21.64,3.86 U$3.29
A1  (via drill 0.33)
  Top 0.152: v16.23,22.53 16.23,31.45 15.7,31.98 15.7,34.49 22.1,40.89 23.32,40.89 U5.24
  Bottom 0.152: v16.23,22.53 16.23,9.12 20.27,5.08 U$3.31
A2  (via drill 0.33)
  Top 0.152: v27.28,26.95 29.26,26.95 36.5,34.19 36.5,42.95 35.81,43.64 26.21,43.64 24.99,42.42 21.87,42.42 U5.25 | v26.44,16.28 22.94,16.28 21.34,14.68 v21.18,14.68
  Bottom 0.152: v27.28,26.95 26.44,26.11 v26.44,16.28 | v21.18,14.68 21.18,8.43 24.08,5.54 24.08,4.62 23.16,3.71 21.95,3.71 20.8,2.57 20.34,2.57 U$3.32
D+  (via drill 0.33)
  Top 0.152: v7.47,14.22 8.08,13.61 8.69,13.61 U2.15 | v6.4,28.55 5.79,29.16 5.26,29.16 JP7.D+
  Bottom 0.152: v7.47,14.22 7.47,27.48 v6.4,28.55
D-  (via drill 0.33)
  Top 0.152: v9.98,14.83 9.37,14.22 8.76,14.22 U2.16 | v6.4,29.39 6.25,29.39 5.79,29.84 5.26,29.84 JP7.D-
  Bottom 0.152: v9.98,14.83 9.98,25.81 v6.4,29.39
DTR
  Top 0.152: 1.37,21.39 0.84,21.39 0.46,21.77 0.46,47.9 2.13,49.58 3.58,49.58 5.33,51.33 7.09,51.33 7.92,50.49 7.92,47.45 8.99,46.38 C18.1
FT232_VCC
  Top 0.152: 5.18,7.52 6.33,7.52 C2.1 6.4,7.52 6.63,7.52 9.03,9.92 | 5.18,7.52 2.59,7.52 C6.2 | 5.18,7.52 5.18,4.32 6.33,3.17 6.33,2.41 C5.1 | 9.03,9.92 10.13,8.81 R2.1 10.21,8.81 18.74,8.81 21.95,12.01 22.94,12.01 U$2.3 | 9.03,9.92 8.99,9.96 8.99,12.47 10.59,14.07 10.59,15.52 9.37,16.74 8.76,16.74 U2.20
FUSE_DIODE_PI  (via drill 0.33)
  Top 0.508: v44.5,32.97 44.5,34.42 F1.2
  Bottom 0.508: v44.5,32.97 44.5,30.99 45.87,29.62 45.87,16.66 D1.A
GND-ISO  (via drill 0.33)
  Top 0.508: C13.2 39.39,47.14 43.81,47.14 44.42,47.75 CIO.2 44.5,47.98 44.5,48.21 48.46,52.17 50.67,52.17 51.97,50.88 C8.2 52.2,48.36 | 38.33,42.04 43.89,42.04 44.27,41.66 44.27,41.12 45.34,40.06 45.64,40.06 U4.3 | 38.33,42.04 38.02,41.73 38.02,39.29 39.32,38 C16.2 | C13.2 39.24,46.91 39.24,46.53 38.02,45.31 38.02,42.49 38.25,42.27 38.33,42.04 | U3.5 48.39,44.55 U3.4 48.62,45.39 49.07,45.39 49.38,45.7 49.38,46.84 | 49.38,46.84 50.52,46.84 50.6,46.91 U3.12 50.9,46.84 51.36,46.84 | 49.38,46.84 49.07,46.84 49,46.91 48.46,46.91 U3.2 | 51.36,46.84 53.87,44.32 54.56,44.32 C14.2 | 52.2,48.36 52.2,47.83 51.43,47.07 51.36,46.84 | 60.35,47.14 62.18,47.14 C11.2 | 60.35,47.14 58.45,47.14 C12.2 58.22,47.22 57.07,48.36 52.2,48.36 | 60.35,40.82 62.18,40.82 C9.2 | 60.35,40.82 58.45,40.82 C10.2 58.22,40.66 57.3,40.66 54.79,38.15 C15.2 54.56,38 49.53,38 C17.2 | 60.35,40.82 60.35,47.14 | 14.02,39.29 13.72,38.99 13.72,38 13.94,37.77 14.71,37.77 U5.5 | 14.02,39.29 14.71,39.29 U5.3 | v11.51,47.68 9.07,50.11 C20.2 | 14.02,39.29 12.8,40.51 12.8,44.55 SW4.2 15.32,47.22 20.27,52.17 20.27,53.31 PI.2 20.5,53.54 21.64,54.69 25.98,54.69 27.28,53.39 27.89,53.39 JP6.2 28.12,53.47 29.72,55.07 38.33,55.07 39.47,53.92 39.47,47.37 C13.2 | 3.3V.2 2.59,48.21 2.59,47.68 6.33,43.94 6.33,39.75 C19.2 6.33,39.45 6.33,38.99 3.89,36.55 3.89,34.57 2.59,33.27 JP7.MT1 2.67,32.97 v3.89,31.75 | U5.21 23.39,38.46 25.15,38.46 25.6,38 31.17,38 31.24,38.08 LED7.C 31.47,38.23 32.31,38.23 33.38,39.29 35.66,39.29 | 32.54,34.34 32.69,34.34 35.28,36.93 35.74,36.93 35.97,37.16 35.97,38.99 35.66,39.29 | 32.54,34.34 31.32,34.34 LED8.C
  Top 0.508: LED6.C 31.32,41.96 32.46,41.96 33.6,43.1 35.66,43.1 35.97,42.8 35.97,39.75 35.74,39.52 35.66,39.29 | R12.1 19.05,24.05 25.38,24.05 R13.1 25.6,23.82 26.67,22.76 26.67,22.53 | 26.67,22.53 R11.1 | 35.59,22.53 35.59,21.46 39.24,17.8 R9.1 39.32,17.58 39.32,12.47 36.42,9.58 35.66,9.58 U$1.1 35.43,9.35 32.84,9.35 28.73,5.23 28.12,5.23 U$3.25 27.89,5.08 23.47,9.5 22.94,9.5 U$2.1 22.71,9.42 20.04,9.42 17.07,6.45 11.58,6.45 10.36,5.23 U$3.39 10.13,5.08 10.06,5.16 7.7,5.16 | 35.59,22.53 35.59,29.16 IC1.1 | 35.59,22.53 26.67,22.53 | v32.54,34.11 32.54,34.34 | U$3.9 48.54,5.08 50.67,7.21 50.67,9.27 49.07,10.87 49.07,11.41 STATUS2.C 49.3,11.48 50.44,12.62 53.49,12.62 54.63,11.48 56.62,11.48 STATUS1.C 56.84,11.25 56.84,10.72 58.6,8.97 58.6,6.83 59.82,5.61 59.82,2.03 58.98,1.19 54.79,1.19 53.57,2.41 U$3.6 53.34,2.49 52.65,2.49 51.36,1.19 44.58,1.19 43.36,2.41 U$3.14 41.83,1.19 37.49,1.19 36.2,2.49 35.59,2.49 U$3.20 35.36,2.41 34.82,2.41 33.6,1.19 24.31,1.19 23.09,2.41 U$3.30 22.86,2.49 21.56,1.19 19.74,1.19 18.44,2.49 17.83,2.49 U$3.34 17.6,2.41 17.07,2.41 15.85,1.19 8.08,1.19 7.92,1.35 7.7,1.42 | U2.26 8.76,20.7 8.76,20.09 U2.25 8.99,20.02 9.6,20.02 9.91,19.71 9.91,17.8 9.6,17.5 8.99,17.5 U2.21 8.69,17.42 7.85,17.42 7.62,17.2 | 7.62,17.2 7.62,15.75 7.85,15.52 8.69,15.52 U2.18 | 5.18,18.11 6.55,18.11 7.39,17.27 7.62,17.2 | 5.18,18.11 1.45,18.11 U2.7 | 5.18,18.11 5.18,25.2 | 5.18,25.2 5.18,27.86 JP7.GND | v4.04,25.2 2.59,25.2 JP7.MT2 | v5.26,25.2 5.18,25.2 | 7.7,5.16 6.4,5.16 C5.2 | C2.2 6.33,10.34 2.74,10.34 C6.1 2.51,10.26 1.22,8.97 1.22,6.53 2.51,5.23 C1.2 2.67,5 3.89,3.79 3.89,2.57 5.26,1.19 7.47,1.19 7.7,1.42
  Top 0.508: 7.7,1.42 7.7,5.16
  Bottom 0.508: SW4.2 14.55,47.68 v11.51,47.68 11.28,47.75 10.82,48.21 2.59,48.21 3.3V.2 | v32.54,34.11 32.54,32.21 35.51,29.23 IC1.1 | U$3.39 10.13,5.08 5.33,9.88 5.33,24.97 v5.26,25.2 v4.04,25.2 3.89,25.35 v3.89,31.75
GP13  (via drill 0.33)
  Top 0.152: v36.73,3.71 51.13,3.71 51.97,4.55 51.97,5.38 54.79,8.2 57,8.2 R3.1
  Bottom 0.152: v36.73,3.71 35.05,3.71 34.21,2.87 34.21,2.03 33.53,1.35 19.81,1.35 18.97,2.18 18.97,3.94 17.83,5.08 U$3.33
GP16
  Top 0.152: R4.1 49.38,8.2 39.55,8.2 36.73,5.38 36.73,4.55 35.89,3.71 16.38,3.71 15.24,2.57 U$3.36
MISO  (via drill 0.33)
  Top 0.152: v21.87,35.48 21.87,33.81 U5.16 | JP6.5 37.41,51.49 37.41,47.9 34.98,45.47 v29.79,45.47 14.48,45.47 13.56,44.55 v13.56,44.25
  Bottom 0.152: v21.87,35.48 27.51,41.12 27.51,43.18 v29.79,45.47 | U$3.21 32.16,5.08 25.38,11.86 24.92,11.86 16.84,19.94 16.84,22.76 9.22,30.38 6.78,30.38 1.37,35.79 1.37,40.74 JP2.3 2.59,41.88 4.95,44.25 v13.56,44.25
MOSI  (via drill 0.33)
  Top 0.152: v22.17,36.63 21.11,35.56 21.11,33.81 U5.15 | 37.49,44.25 37.49,47.52 37.72,47.75 37.72,52.02 36.73,53.01 36.73,53.85 36.04,54.53 34.21,54.53 JP6.4 | 37.49,44.25 37.49,37.77 39.93,35.33 39.93,27.48 38.18,25.73 38.18,19.63 38.41,19.41 39.62,19.41 40.54,18.49 40.54,12.62 35.59,7.67 35.59,5.08 U$3.19 | v16.15,43.64 18.59,43.64 19.2,44.25 37.49,44.25
  Bottom 0.152: v22.17,36.63 22.4,36.63 27.2,41.43 27.2,50.88 29.26,52.93 29.26,53.85 29.95,54.53 31.85,54.53 32.99,53.39 JP6.4 | JP2.2 11.89,39.37 v16.15,43.64
N$1
  Top 0.152: LED1.A 8.92,24.89 8.92,23.06 13.94,18.03 13.94,17.65 R1.1
N$2
  Top 0.152: LED2.A 12.72,24.89 13.03,24.89 20.27,17.65 R5.1
N$10
  Top 0.152: STATUS2.A 52.5,11.41 52.5,8.51 52.27,8.28 R4.2
N$11
  Top 0.152: STATUS1.A 60.12,11.41 60.12,8.51 59.89,8.28 R3.2
N$16
  Top 0.152: U4.2 45.64,38.76 44.42,38.76 43.74,39.45 40.69,39.45 39.39,40.74 C16.1
N$25
  Top 0.152: LED6.A 34.75,41.88 33.07,41.88 32.08,40.89 24.61,40.89 24.08,41.43 22.63,41.43 22.4,41.2 21.95,41.2 15.16,34.42 15.16,30.53 R18.1
N$26
  Top 0.152: LED7.A 34.75,38.08 33.22,38.08 25.6,30.45 25.6,28.93 25.15,28.47 23.47,28.47 21.49,30.45 R19.1
N$27
  Top 0.152: LED8.A 34.75,34.27 33.53,34.27 31.17,31.9 29.03,31.9 27.81,30.68 27.81,30.53 R20.1
PD5
  Top 0.152: U5.9 16.31,33.81 16.31,32.13 17.91,30.53 R18.2
PD6
  Top 0.152: U5.10 17.07,33.81 17.07,33.35 18.06,32.36 22.4,32.36 24.23,30.53 R19.2
PD7  (via drill 0.33)
  Top 0.152: v19.66,35.56 18.44,35.56 17.91,35.03 17.91,33.81 U5.11 | v29.26,31.29 29.79,31.29 30.56,30.53 R20.2
  Bottom 0.152: v19.66,35.56 20.95,35.56 25.22,31.29 v29.26,31.29
PI_3.3V
  Bottom 0.152: U$3.17 38.94,5.08 40.16,6.3 57.15,6.3 58.37,5.08 U$3.1
PI_5V  (via drill 0.33)
  Top 0.508: U$3.4 55.93,2.57 58.37,2.57 U$3.2 | v28.88,50.27 v20.88,50.27
  Bottom 0.508: v20.88,50.27 17.83,53.31 PI.1 | v28.88,50.27 30.86,50.27 47.4,33.73 47.4,25.81 54.56,18.64 54.56,15.29 D1.C 59.82,10.03 59.82,4.55 58.45,3.17 58.45,2.57 U$3.2
PI_N_DRAIN
  Top 0.152: U$2.8 17.68,9.58 17.68,10.8 U$2.7 19.89,10.8 22.4,13.31 22.94,13.31 U$2.4 22.94,13.39 24,14.45 26.82,14.45 32.77,20.4 32.99,20.4 R10.1
PI_P_DRAIN  (via drill 0.33)
  Top 0.508: U$2.6 17.68,12.09 17.68,13.31 U$2.5 17.91,13.46 21.03,13.46 22.63,15.06 v26.59,15.06 | 40.46,21.54 40.46,28.02 44.04,31.6 44.42,31.6 F1.1 | 40.46,21.54 39.39,20.47 R9.2 | SW2.1 46.56,20.32 44.88,18.64 43.51,18.64 40.69,21.46 40.46,21.54
  Bottom 0.508: v26.59,15.06 26.59,14.91 33.68,7.82 39.01,7.82 50.75,19.56 50.75,20.32 SW2.1
PI_PWR_CNTRL  (via drill 0.33)
  Top 0.152: v24.92,29.08 25.3,29.46 25.3,31.52 24.16,32.66 v22.94,32.66 20.12,32.66 19.51,33.27 19.51,33.81 U5.13 | v25.22,18.19 26.14,18.19 26.67,17.65 R11.2 | U$2.2 23.47,10.8 v25.15,12.47 | v13.49,46.91 12.72,47.68 12.72,53.31 CNTRL_INPUTS.2
  Bottom 0.152: v24.92,29.08 24.92,18.49 v25.22,18.19 25.15,18.19 v25.15,12.47 | v13.49,46.91 16.15,44.25 16.38,44.25 18.06,42.57 18.06,32.28 19.2,31.14 21.41,31.14 v22.94,32.66
RESET  (via drill 0.33)
  Top 0.152: R15.2 35.59,48.9 35.55,48.93 | 35.55,48.93 31.17,53.31 30.48,53.31 JP6.3 | v19.43,43.64 18.67,42.88 18.67,42.42 U5.29 | v4.95,48.97 6.17,47.75 6.17,46.38 C18.2 | 35.55,48.93 34.59,47.98 34.59,47.9 33.68,46.99 SW4.1
  Bottom 0.152: 20.16,44.36 22.78,46.99 SW4.1 | 20.16,44.36 v19.43,43.64 | v4.95,48.97 4.95,49.81 9.68,54.53 10.67,54.53 11.51,53.7 11.51,52.86 16,48.36 16.15,48.36 20.16,44.36
RXI  (via drill 0.33)
  Top 0.152: v16.99,41.2 16.99,42.34 U5.31 | v7.47,31.29 4.72,31.29 4.19,30.76 4.19,25.88 4.65,25.43 4.65,22.07 1.98,19.41 1.45,19.41 U2.5
  Bottom 0.152: v16.99,41.2 16.99,40.82 v7.47,31.29
RXLED
  Top 0.152: U2.22 8.69,18.11 8.15,18.11 7.47,18.8 7.47,28.85 8.08,29.46 11.66,29.46 12.65,28.47 LED2.C
SCL  (via drill 0.33)
  Top 0.152: v20.12,41.2 19.51,41.81 19.51,42.34 U5.28 | v25.22,40.28 25.68,40.28 26.67,39.29 R17.1 26.67,39.37 32.38,39.37 v32.77,39.75 | v47.4,49.96 U3.14 | v46.41,35.79 45.72,35.79 44.04,37.47 43.28,37.47 U4.8 43.2,37.54 42.82,37.92 v42.14,37.92
  Bottom 0.152: v20.12,41.2 24.31,41.2 v25.22,40.28 | v47.4,49.96 46.56,49.96 46.44,50.08 | JP9.2 46.44,50.08 | v46.41,35.79 46.41,50.04 46.44,50.08 | v32.77,39.75 40.31,39.75 v42.14,37.92
SCLK  (via drill 0.33)
  Top 0.152: v26.52,37.24 24.61,35.33 23.39,35.33 U5.17 | v30.4,44.86 v14.71,44.86 | v33.98,8.59 U$3.23
  Bottom 0.152: v26.52,37.24 26.52,38.3 29.91,41.69 | 29.91,41.69 30.4,42.19 v30.4,44.86 30.4,47.9 28.27,50.04 28.27,50.49 29.95,52.17 36.96,52.17 38.1,53.31 JP6.6 | v14.71,44.86 5.1,44.86 4.72,44.48 2.59,44.48 JP2.4 | v33.98,8.59 33.98,11.63 43.59,21.23 43.59,25.27 45.34,27.03 45.34,29.46 35.66,39.14 32.46,39.14 29.91,41.69
SDA  (via drill 0.33)
  Top 0.152: v21.03,43.64 20.27,42.88 20.27,42.42 U5.27 | v25.91,47.68 27.13,48.9 R16.1 | v49.68,49.35 50.6,48.44 50.6,47.75 U3.13 | v47.47,36.4 45.57,36.4 43.28,38.68 U4.7
  Bottom 0.152: v21.03,43.64 21.87,43.64 v25.91,47.68 25.91,52.17 26.75,53.01 26.75,53.85 27.74,54.84 44.27,54.84 45.72,53.39 JP9.1 45.72,53.31 v49.68,49.35 49.61,49.35 47.47,47.22 v47.47,36.4
SENS_N_DRAIN  (via drill 0.33)
  Top 0.152: U$1.8 U$1.7 31.47,10.8 33.98,13.31 35.59,13.31 U$1.4 35.59,13.39 v35.59,15.44 | v33.15,23.29 32.46,23.98 31.77,23.98 R14.1
  Bottom 0.152: v33.15,23.29 33.15,17.88 v35.59,15.44
SENS_P_DRAIN  (via drill 0.33)
  Top 0.152: 49.95,26.99 56.62,20.32 SW3.1 | 49.95,26.99 49.91,27.03 49.91,28.85 50.75,29.69 50.75,31.6 F2.1 | v27.28,26.11 26.59,26.8 25.45,26.8 R13.2 | v29.64,14.15 30.4,13.39 U$1.5 U$1.6 | v41.22,26.49 44.81,26.49 45.26,26.95 49.91,26.95 49.95,26.99
  Bottom 0.152: v29.64,14.15 27.28,16.51 v27.28,26.11 27.66,26.49 v41.22,26.49
SENSOR_POWER
  Top 0.152: 45.61,46.11 44.5,45.01 CIO.1 44.42,44.93 43.81,44.32 39.39,44.32 C13.1 | 45.61,46.11 47.17,47.68 48.39,47.68 U3.1 | 46.44,38.27 46.48,38.3 46.48,40.44 46.44,40.48 | 46.44,38.27 45.72,37.54 U4.1 | 46.44,40.48 45.72,41.2 U4.4 | 46.44,38.27 50.22,34.49 50.75,34.49 F2.2 | 57.34,44.36 54.63,47.07 C14.1 | 57.34,44.36 57.38,44.32 58.37,44.32 C12.1 | 49.53,40.82 U3.7 49.53,43.64 48.54,43.64 48.46,43.71 U3.6 48.39,43.79 47.93,43.79 45.61,46.11 | 49.53,40.82 54.56,40.82 C15.1 54.56,40.89 57.3,43.64 57.3,44.32 57.34,44.36 | 49.53,40.82 C17.1 49.53,40.74 49.3,40.51 46.48,40.51 46.44,40.48
SENSOR_PWR_CNTRL  (via drill 0.33)
  Top 0.152: v18.67,34.95 18.67,33.81 U5.12 | v19.43,31.75 19.05,31.37 R12.2 19.05,26.8 19.74,26.11 v20.5,26.11 | U$1.2 33.45,10.8 31.62,8.97 29.18,8.97 25.76,12.39 25.76,12.7 24.61,13.84 v24.54,13.84
  Bottom 0.152: CNTRL_INPUTS.1 10.21,53.31 15.47,48.06 16,48.06 18.67,45.39 v18.67,34.95 19.43,34.19 v19.43,31.75 | v24.54,13.84 24.54,22.07 v20.5,26.11
SS  (via drill 0.33)
  Top 0.152: v20.27,34.95 20.27,33.81 U5.14 | v20.27,31.75 20.27,30.38 v19.66,29.77
  Bottom 0.152: v20.27,31.75 v20.27,34.95 | JP2.1 2.59,36.78 2.59,35.33 7.24,30.68 9.37,30.68 10.29,29.77 v19.66,29.77 25.07,29.77 25.83,29.01 25.83,14.99 34.21,6.6 34.21,4.55 33.53,3.86 32.61,3.86 31.32,2.57 30.48,2.57 U$3.24
TXLED
  Top 0.152: U2.23 8.69,18.8 8.08,18.8 7.77,19.1 7.77,27.33 8.84,28.4 LED1.C
TXO  (via drill 0.33)
  Top 0.152: v15.93,40.59 17.22,40.59 17.83,41.2 17.83,42.34 U5.30 | v5.87,32.89 3.73,30.76 3.73,26.87 3.2,26.34 1.45,26.34 1.29,26.19 1.29,22.15 1.37,22.07 U2.1
  Bottom 0.152: v15.93,40.59 13.56,40.59 v5.87,32.89
VCCIO
  Top 0.152: 0.69,13.08 0.46,13.31 0.46,19.63 0.84,20.02 1.37,20.02 U2.4 | 0.69,13.08 5.49,13.08 7.24,14.83 8.69,14.83 U2.17 | 0.69,13.08 0.69,5 2.51,3.17 2.51,2.41 C1.1
XTAL1
  Top 0.152: U5.7 14.71,36.17 14.25,36.17 10.21,40.21 10.21,40.59 Q5.2 7.92,42.88 7.92,46.69 6.25,48.36 6.25,50.11 C20.1
XTAL2
  Top 0.152: U5.8 14.71,35.33 10.44,35.33 10.21,35.56 Q5.1 10.13,35.56 9.07,36.63 6.4,36.63 C19.1

### Text on the board
tNames: SCL | SDA
bNames: TDS rev2 | CRT